# Altium schematic sheet Power&CH341T.SchDoc
size A4
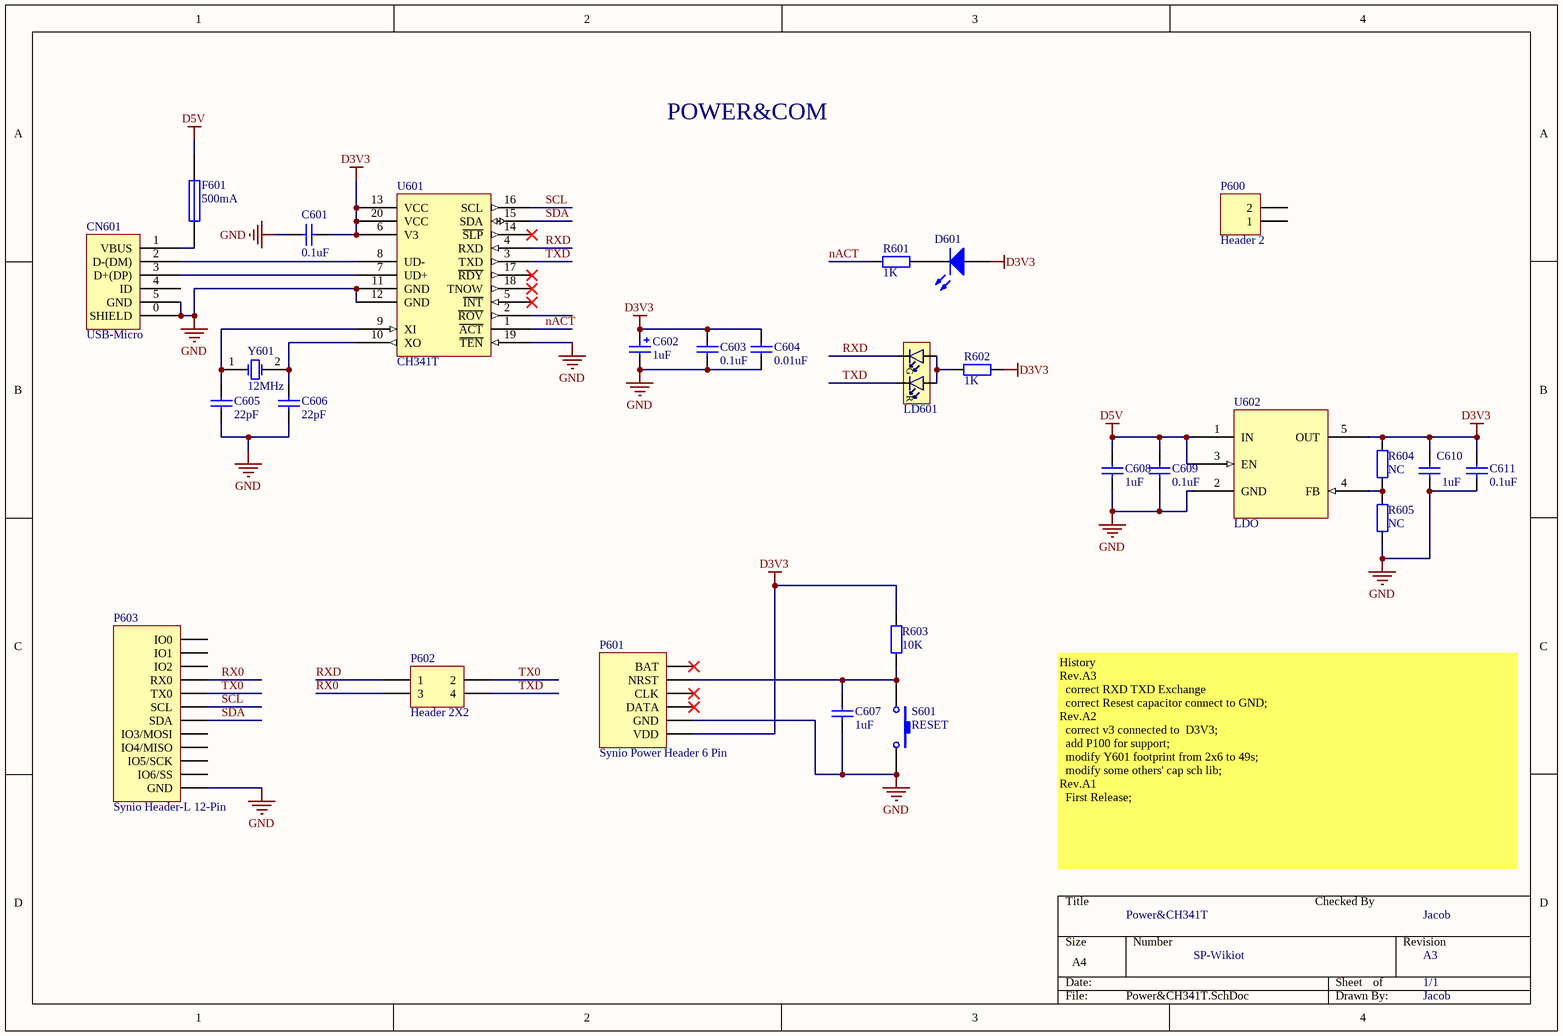
[diagram p0: Power&CH341T.SchDoc]

## Parts
C601  0.1uF  [C0603L]
C602  1uF  [0805M]
C603  value 0.1uF  [C0603L]  (hidden comment: Cap)
C604  value 0.01uF  [C0603L]  (hidden comment: Cap)
C605  value 22pF  [C0603L]  (hidden comment: Cap)
C606  value 22pF  [C0603L]  (hidden comment: Cap)
C607  1uF  [C0603L]
C608  value 1uF  [C0603L]  (hidden comment: Cap)
C609  value 0.1uF  [C0603L]  (hidden comment: Cap)
C610  value 1uF  [C0603L]  (hidden comment: Cap)
C611  value 0.1uF  [C0603L]  (hidden comment: Cap)
CN601  USB-Micro  [USB-MICRO-Lite]
D601  LED1  [0603pn]  (value not drawn)
F601  500mA  [0805]
LD601  LTST-C195KGJRKT  [0805-LED-Bi]  (value not drawn)
P600  Header 2  [HDR1X2]
P601  Synio Power Header 6 Pin  [HDR1X6/2.54MM]
P602  Header 2X2  [HDR2X2/2.54MM]
P603  Synio Header-L 12-Pin  [HDR1X12]
R601  1K  [R0603]
R602  1K  [0603M]
R603  10K  [0603M]
R604  NC  [0603M]
R605  NC  [0603M]
S601  RESET  [KEY-2x4-SMD]
U601  CH341T  [SSOP20]
U602  LDO  [SOT23-5]
Y601  12MHz  [XTAL_49S]

## Nets
D3V3: C601.2 C602.1 C603.2 C604.2 C610.2 C611.2 D601.1(A) P601.1(VDD) R602.1 R603.1 R604.1 U601.6(V3) U601.13(VCC) U601.20(VCC) U602.5(OUT)
D5V: C608.2 C609.2 F601.1 U602.1(IN) U602.3(EN)
GND: C601.1 C602.2 C603.1 C604.1 C605.1 C606.1 C607.1 C608.1 C609.1 C610.1 C611.1 CN601.0(SHIELD) CN601.5(GND) P601.2(GND) P603.1(GND) R605.1 S601.1 U601.11(GND) U601.12(GND) U601.19(~{TEN}) U602.2(GND)
nACT: R601.1 U601.1(~{ACT})
RX0: P602.3 P603.9(RX0)
RXD: LD601.1(C1) P602.1 U601.4(RXD)
SCL: P603.7(SCL) U601.16(SCL)
SDA: P603.6(SDA) U601.15(SDA)
TX0: P602.2 P603.8(TX0)
TXD: LD601.2(C2) P602.4 U601.3(TXD)
NetC605_2: C605.2 U601.9(XI) Y601.1(OSC1)
NetC606_2: C606.2 U601.10(XO) Y601.2(OSC2)
NetC607_2: C607.2 P601.5(NRST) R603.2 S601.2
NetCN601_1: CN601.1(VBUS) F601.2
NetCN601_2: CN601.2(D-(DM)) U601.8(UD-)
NetCN601_3: CN601.3(D+(DP)) U601.7(UD+)
NetD601_2: D601.2(K) R601.2
NetLD601_3: LD601.3(A2) LD601.4(A1) R602.2
NetR604_2: R604.2 R605.2 U602.4(FB)

Not connected (* = marked no-connect by the designer): CN601 4(ID); P600 1 2; P601 3(DATA)* 4(CLK)* 6(BAT)*; P603 2(IO6/SS) 3(IO5/SCK) 4(IO4/MISO) 5(IO3/MOSI) 10(IO2) 11(IO1) 12(IO0); U601 2(~{ROV}) 5(~{INT})* 14(~{SLP})* 17(~{RDY})* 18(TNOW)*

## Notes on the sheet
- POWER&COM
- History
  Rev.A3
  correct RXD TXD Exchange
  correct Resest capacitor connect to GND;
  Rev.A2
  correct v3 connected to  D3V3;
  add P100 for support;
  modify Y601 footprint from 2x6 to 49s;
  modify some others' cap sch lib;
  Rev.A1
  First Release;
- Power&CH341T
- Checked By
- Jacob
- SP-Wikiot
- A3
- 1/1
- (in symbol LED-DUAL) G; R

## Library data of the parts
C601 C603-C611 = Cap: Capacitor; Published: 8-Jun-2000; LatestRevisionDate: 17-Jul-2002; LatestRevisionNote: Re-released for DXP Platform.; PackageReference: RAD-0.3
  C601: Value: 0.1uF
  C603-C606 C608-C611: Publisher: Altium Limited
  C607: Publisher: Altium Limited; Value: 1uF
C602 = Cap Pol1: Polarized Capacitor (Radial); Published: 8-Jun-2000; LatestRevisionDate: 17-Jul-2002; LatestRevisionNote: Re-released for DXP Platform.; PackageReference: RB7.6-15; Publisher: Altium Limited; Value: 1uF
D601 = LED1: Typical RED GaAs LED; Published: 8-Jun-2000; LatestRevisionDate: 08-Jul-2005; LatestRevisionNote: Mech Layer 1 removed.; PackageReference: LED-1; Publisher: Altium Limited
F601 = Fuse 1: Fuse; Published: 8-Jun-2000; LatestRevisionDate: 17-Jul-2002; LatestRevisionNote: Re-released for DXP Platform.; PackageReference: PIN-W2/E2.8; Publisher: Altium Limited; PackageDescription: Thru-Hole; 2 Leads
LD601 = LED-DUAL: Avago, HSMF-A203 Bi-Color LED; Manufacturer: Lite-On Inc; 2nd source part number: 859-LTST-C195KGJRKT; Note: HSMF-A203- xxxxx GaP Red GaP Emerald Green; Artikkelnr Noca: 13019145; Part Number: LTST-C195KGJRKT; Manufacturer Part Number: LTST-C195KGJRKT; Datasheet: http://media.digikey.com/pdf/Data%20Sheets/Lite-On%20PDFs/LTST-C195KGJRKT.pdf; Footprint: LED_DUAL_0606; LatestRevisionDate: 2012-07-05; Pin Count: 4; Publisher: Nordic Semiconductor; Published: 2012-07-05; Value: LTST-C195KGJRKT; Supplier: Digi-Key; Supplier part number: 160-1452-1-ND; 2nd source Supplier: Mouser
P600 = Header 2: Header, 2-Pin; LatestRevisionDate: 17-Jul-2002; LatestRevisionNote: Re-released for DXP Platform.; Publisher: Altium Limited
P602 = Header 2X2: Header, 2-Pin, Dual row; LatestRevisionDate: 17-Jul-2002; LatestRevisionNote: Re-released for DXP Platform.; Publisher: Altium Limited
P603 = Synio Header-L 12-Pin: Synio Header-L, 12-Pin; LatestRevisionDate: 17-Jul-2002; LatestRevisionNote: Re-released for DXP Platform.; Publisher: Altium Limited
R601 = Res: Resistor; Published: 8-Jun-2000; LatestRevisionDate: 17-Jul-2002; LatestRevisionNote: Re-released for DXP Platform.; PackageReference: AXIAL-0.4; Publisher: Altium Limited; Value: 1K
R602-R605 = Res2: Resistor; Published: 8-Jun-2000; LatestRevisionDate: 17-Jul-2002; LatestRevisionNote: Re-released for DXP Platform.; PackageReference: AXIAL-0.4; Publisher: Altium Limited
  R602: Value: 1K
  R603: Value: 10K
  R604 R605: Value: NC
S601 = SW-PB: Switch; Published: 24-Mar-1999; LatestRevisionDate: 17-Jul-2002; LatestRevisionNote: Re-released for DXP Platform.; PackageReference: SPST-2; Publisher: Altium Limited
U602 = LDO-SOT23-5: General LDO SOT23-5
Y601 = XTAL: Crystal Oscillator; Published: 8-Jun-2000; LatestRevisionDate: 17-Jul-2002; LatestRevisionNote: Re-released for DXP Platform.; PackageReference: R38; Publisher: Altium Limited